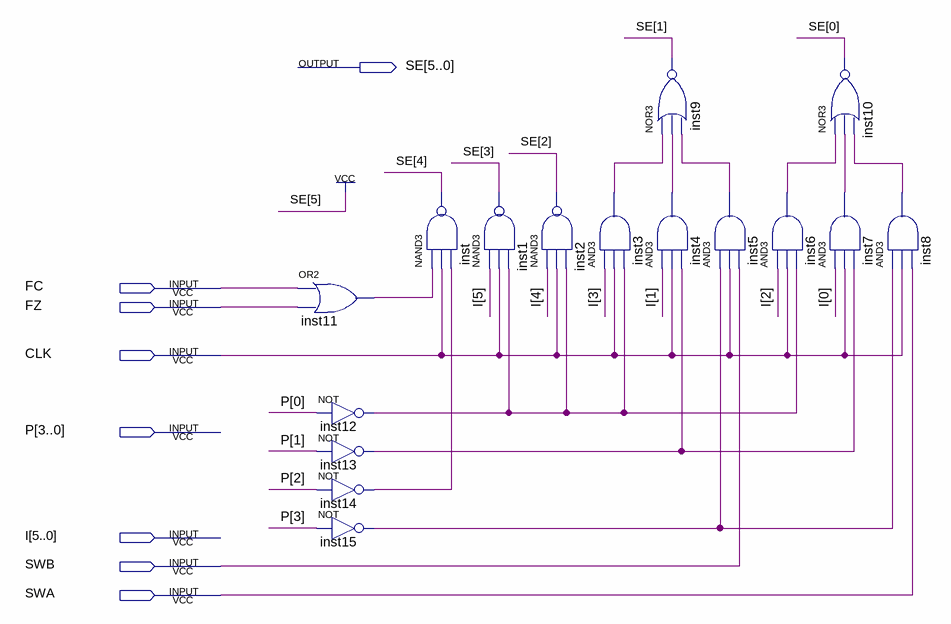
[diagram p0: schematic sheet]
// Quartus schematic ul_C.bdf as structural Verilog: 16 symbols, 8 pins
module ul_C (
  input  FC,
  input  FZ,
  input  CLK,
  input  [3:0] P,
  input  [5:0] I,
  input  SWB,
  input  SWA,
  output [5:0] SE
);

  wire inst3_out, inst4_out, inst5_out, inst6_out, inst7_out, inst8_out, inst11_out, inst12_out, inst13_out,
       inst14_out, inst15_out;

  or inst11 (inst11_out, FC, FZ);
  not inst12 (inst12_out, P[0]);
  not inst13 (inst13_out, P[1]);
  not inst14 (inst14_out, P[2]);
  not inst15 (inst15_out, P[3]);
  nand inst (SE[4], inst11_out, CLK, inst14_out);
  nand inst1 (SE[3], I[5], CLK, inst12_out);
  nand inst2 (SE[2], I[4], CLK, inst12_out);
  and inst3 (inst3_out, I[3], CLK, inst12_out);
  nor inst9 (SE[1], inst3_out, inst4_out, inst5_out);
  and inst4 (inst4_out, I[1], CLK, inst13_out);
  and inst5 (inst5_out, inst15_out, CLK, SWB);
  and inst6 (inst6_out, I[2], CLK, inst12_out);
  nor inst10 (SE[0], inst6_out, inst7_out, inst8_out);
  and inst7 (inst7_out, I[0], CLK, inst13_out);
  and inst8 (inst8_out, inst15_out, CLK, SWA);

  assign SE[5] = 1'b1;
endmodule
